# EAGLE schematic MonitorRed_dsPIC33EP (EAGLE 7.1.0)
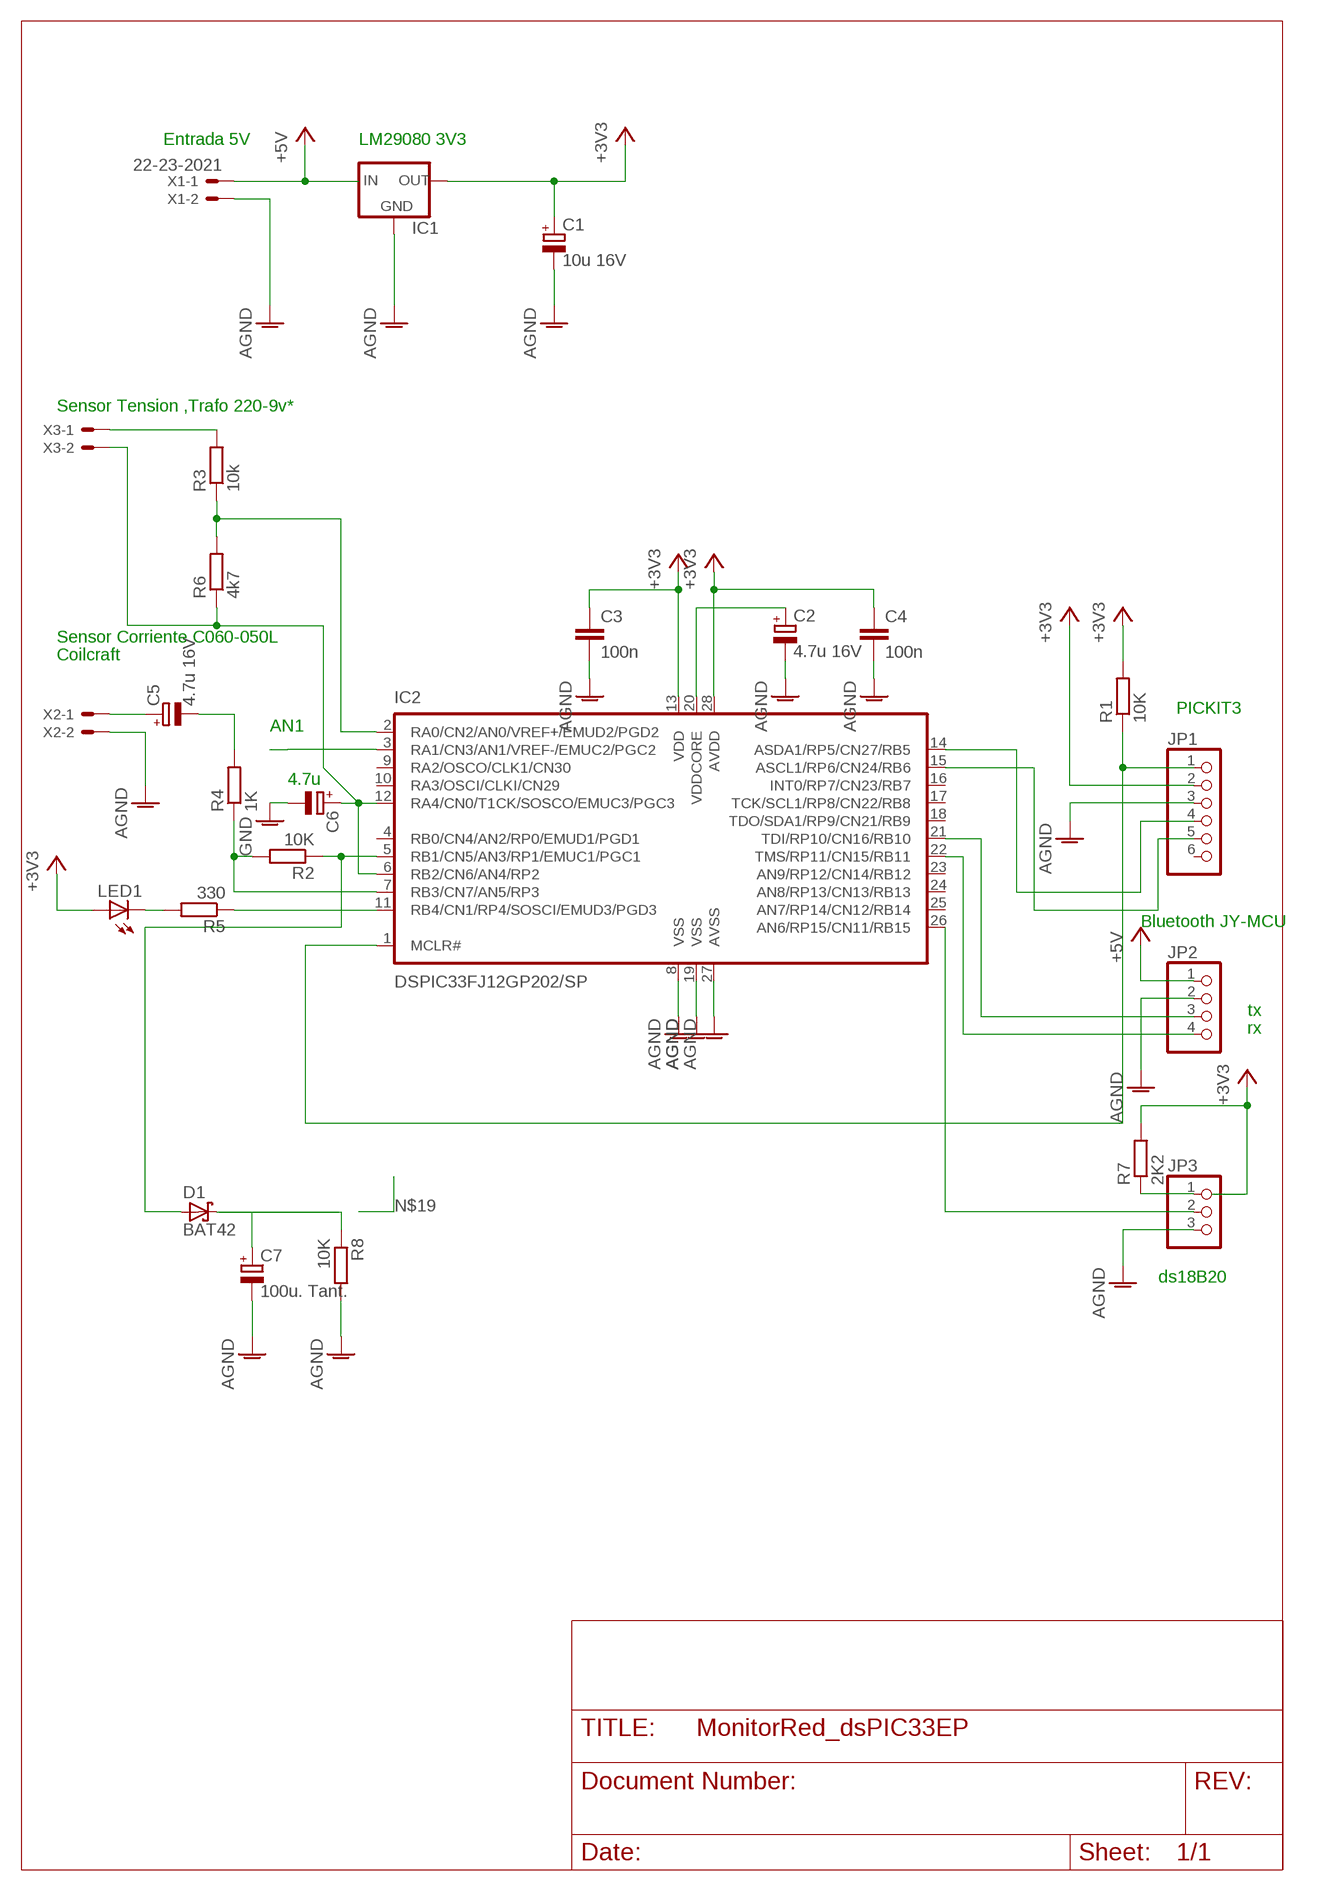
[diagram p0: schematic, sheet 1]

## Parts
C1  10u 16V  CPOL-EUA/3216-18R  [A/3216-18R]
C2  4.7u 16V  CPOL-EUA/3216-18R  [A/3216-18R]
C3  100n  C-EUC0805  [C0805]
C4  100n  C-EUC0805  [C0805]
C5  4.7u 16V  CPOL-EUA/3216-18R  [A/3216-18R]
C6  CPOL-EUA/3216-18R  [A/3216-18R]
C7  100u. Tant.  CPOL-EUA/3216-18R  [A/3216-18R]
D1  BAT42  [DO35-10]
IC1  LP2950CDT-3.0  [DPACK]
IC2  DSPIC33FJ12GP202/SP  [DIL28-3]
JP1  PINHD-1X6/90  [1X06/90]
JP2  PINHD-1X4/90  [1X04/90]
JP3  PINHD-1X3  [1X03]
LED1  LED5MM  [LED5MM]
R1  10K  R-EU_M0805  [M0805]
R2  10K  R-EU_M0805  [M0805]
R3  10k  R-EU_M0805  [M0805]
R4  1K  R-EU_M0805  [M0805]
R5  330  R-EU_M0805  [M0805]
R6  4k7  R-EU_M0805  [M0805]
R7  2K2  R-EU_M0805  [M0805]
R8  10K  R-EU_M0805  [M0805]
X1  22-23-2021  [22-23-2021]
X2  22-23-2021  [22-23-2021]
X3  22-23-2021  [22-23-2021]

## Nets
+3V3: C1.+ C3.1 C4.1 IC1.3(OUT) IC2.13(VDD) IC2.28(AVDD) JP1.2 LED1.A R1.2 R7.2
+5V: JP2.1 X1.1
AGND: C1.- C2.- C3.2 C4.2 C6.- C7.- IC1.4(GND) IC2.8(VSS) IC2.19(VSS) IC2.27(AVSS) JP1.3 JP2.2 JP3.3 R8.2 X1.2 X2.2 ; supply symbol labelled GND
AN1: C7.+ D1.C R8.1
N$1: LED1.K(C) R5.2
N$2: C2.+ IC2.20(VDDCORE)
N$3: IC2.1(MCLR#) JP1.1 R1.1
N$4: D1.A IC2.5(RB1/CN5/AN3/RP1/EMUC1/PGC1) R2.1
N$5: IC2.7(RB3/CN7/AN5/RP3) R2.2 R4.1
N$6: IC2.14(ASDA1/RP5/CN27/RB5) JP1.4
N$7: IC2.15(ASCL1/RP6/CN24/RB6) JP1.5
N$8: C5.- R4.2
N$9: C5.+ X2.1
N$10: IC2.3(RA1/CN3/AN1/VREF-/EMUC2/PGC2)
N$11: R3.2 X3.1
N$12: C6.+ IC2.6(RB2/CN6/AN4/RP2) IC2.12(RA4/CN0/T1CK/SOSCO/EMUC3/PGC3) R6.1 X3.2
N$13: IC2.2(RA0/CN2/AN0/VREF+/EMUD2/PGD2) R3.1 R6.2
N$14: R5.1
N$15: IC2.26(AN6/RP15/CN11/RB15) JP3.2
N$16: JP3.1 R7.1
N$17: IC2.21(TDI/RP10/CN16/RB10) JP2.3
N$18: IC2.22(TMS/RP11/CN15/RB11) JP2.4
Unconnected: IC1.1(IN) IC2.4(RB0/CN4/AN2/RP0/EMUD1/PGD1) IC2.9(RA2/OSCO/CLK1/CN30) IC2.10(RA3/OSCI/CLKI/CN29) IC2.11(RB4/CN1/RP4/SOSCI/EMUD3/PGD3) IC2.16(INT0/RP7/CN23/RB7) IC2.17(TCK/SCL1/RP8/CN22/RB8) IC2.18(TDO/SDA1/RP9/CN21/RB9) IC2.23(AN9/RP12/CN14/RB12) IC2.24(AN8/RP13/CN13/RB13) IC2.25(AN7/RP14/CN12/RB14) JP1.6

## Notes on the sheet
- Entrada 5V | LM29080 3V3
- Sensor Tension ,Trafo 220-9v*
- Sensor Corriente C060-050L
- Coilcraft
- PICKIT3
- AN1
- 4.7u
- Bluetooth JY-MCU
- tx
- rx
- ds18B20

## Library data of the parts
C1 C2 C5-C7 = rcl:CPOL-EU: POLARIZED CAPACITOR, European symbol
C3 C4 = rcl:C-EU: CAPACITOR, European symbol
D1 = diode:BAT42: DIODE barrier diode
IC1 = v-reg:LP2950?*: Source: http://cache.national.com/ds/LP/LP2950.pdf
IC2 = microchip-dspic:DSPIC33FJ12GP202: dsPIC33 General DSC
JP1 = pinhead:PINHD-1X6: PIN HEADER
JP2 = pinhead:PINHD-1X4: PIN HEADER
JP3 = pinhead:PINHD-1X3: PIN HEADER
LED1 = led:LED: LED OSRAM: - CHIPLED LG R971, LG N971, LY N971, LG Q971, LY Q971, LO R971, LY R971 LH N974, LH R974 LS Q976, LO Q976, LY Q976 LO Q996 - Hyper CHIPLED LW Q18S LB Q993, LB Q99A, LB R99A - SideLED LS A670, LO A670, LY A670, LG A670, LP A670 LB A673, LV A673, LT A673, LW A673 LH A674 LY A675 LS A676, LA A676, LO A676, LY A676, LW A676 LS A679, LY A679, LG A679 - Hyper Micro SIDELED® LS Y876, LA Y876, LO Y876, LY Y876 LT Y87S - SmartLED LW L88C, LW L88S LB L89C, LB L89S, LG L890 LS L89K, LO L89K, LY L89K LS L896, LA L896, LO L896, LY L896 - TOPLED LS T670, LO T670, LY T670, LG T670, LP T670 LSG T670, LSP T670, LSY T670, LOP T670, LYG T670 LG T671, LOG T671, LSG T671 LB T673, LV T673, LT T673, LW T673 LH T674 LS T676, LA T676, LO T676, LY T676, LB T676, LH T676, LSB T676, LW T676 LB T67C, LV T67C, LT T67C, LS T67K, LO T67K, LY T67K, LW E67C LS E67B, LA E67B, LO E67B, LY E67B, LB E67C, LV E67C, LT E67C LW T67C LS T679, LY T679, LG T679 LS T770, LO T770, LY T770, LG T770, LP T770 LB T773, LV T773, LT T773, LW T773 LH T774 LS E675, LA E675, LY E675, LS T675 LS T776, LA T776, LO T776, LY T776, LB T776 LHGB T686 LT T68C, LB T68C - Hyper Mini TOPLED® LB M676 - Mini TOPLED Santana® LG M470 LS M47K, LO M47K, LY M47K Source: http://www.osram.convergy.de LUXEON: - LUMILED® LXK2-PW12-R00, LXK2-PW12-S00, LXK2-PW14-U00, LXK2-PW14-V00 LXK2-PM12-R00, LXK2-PM12-S00, LXK2-PM14-U00 LXK2-PE12-Q00, LXK2-PE12-R00, LXK2-PE12-S00, LXK2-PE14-T00, LXK2-PE14-U00 LXK2-PB12-K00, LXK2-PB12-L00, LXK2-PB12-M00, LXK2-PB14-N00, LXK2-PB14-P00, LXK2-PB14-Q00 LXK2-PR12-L00, LXK2-PR12-M00, LXK2-PR14-Q00, LXK2-PR14-R00 LXK2-PD12-Q00, LXK2-PD12-R00, LXK2-PD12-S00 LXK2-PH12-R00, LXK2-PH12-S00 LXK2-PL12-P00, LXK2-PL12-Q00, LXK2-PL12-R00 Source: www.luxeon.com KINGBRIGHT: KA-3528ASYC Source: www.kingbright.com
R1-R8 = rcl:R-EU_: RESISTOR, European symbol
X1-X3 = con-molex:22-23-2021: .100" (2.54mm) Center Header - 2 Pin; MF: MOLEX; MPN: 22-23-2021; OC_FARNELL: 1462926; OC_NEWARK: 25C3832